# Altium schematic sheet TP_IHM_BUZZER.SchDoc
size A4
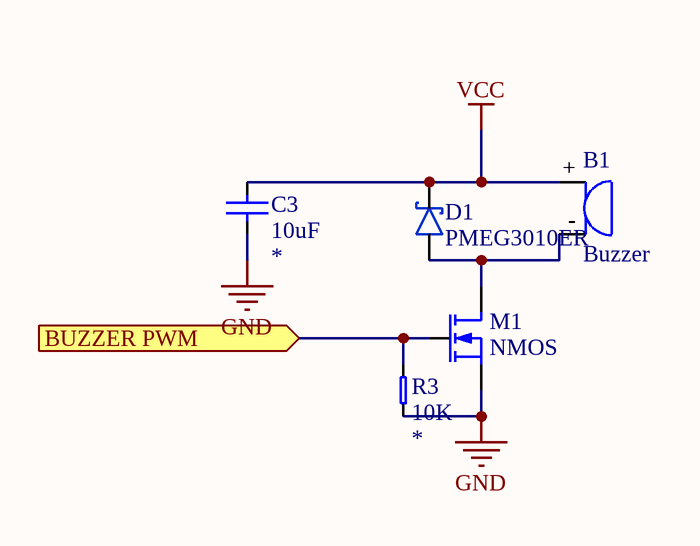
[diagram p0: TP_IHM_BUZZER.SchDoc]

## Parts
B1  Buzzer  [SD160709]
C3  value 10uF  [0603_CAP_LD]  (hidden comment: CerCap)
D1  PMEG3010ER  [SOD123W]
M1  NMOS  [MOSFET-SOT23]
R3  value 10K  [0603_RES_LD]  (hidden comment: Resistor)

## Ports
BUZZER PWM (in)

## Nets
GND: C3.1 M1.S R3.1
VCC: B1.+ C3.2 D1.K
BUZZER PWM: M1.G R3.2 ; port BUZZER PWM
NetB1_-: B1.- D1.A M1.D

## Library data of the parts
B1 = SD160709: TDK SD160709 Buzzer; Reference: SD160709
C3 = CerCap: Ceramic Capacitor; Type: *; Voltage/Power: *; Package: *
D1 = Schottky_PMEG3010ER: Nexperia 1A low Vf Mega Schottky barrier rectifier; Reference: PMEG3010ER
M1 = N-MOSFET: N MOSFET
R3 = Resistor: Precision: *; Package: *